# EAGLE design LedDriver (EAGLE 6.6.0)
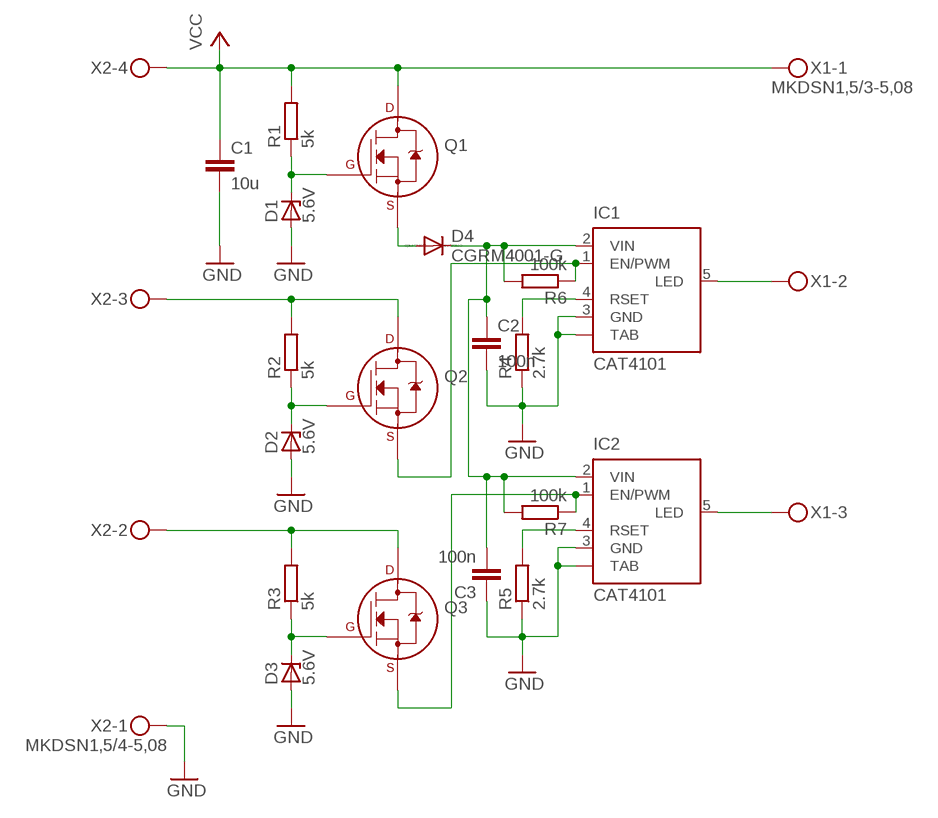
[diagram p0: schematic, sheet 1]

## Parts
C1  10u  C-EUC1210  [C1210]
C2  100n  C-EUC0402  [C0402]
C3  100n  C-EUC0402  [C0402]
D1  5.6V  ZENER-DIODESOD80C  [SOD80C]
D2  5.6V  ZENER-DIODESOD80C  [SOD80C]
D3  5.6V  ZENER-DIODESOD80C  [SOD80C]
D4  CGRM4001-G  [SOD-123_MINI-SMA]
IC1  CAT4101  [TO263_5]
IC2  CAT4101  [TO263_5]
Q1  2N7002_SOT23  [SOT-23]
Q2  2N7002_SOT23  [SOT-23]
Q3  2N7002_SOT23  [SOT-23]
R1  5k  R-EU_R0603  [R0603]
R2  5k  R-EU_R0603  [R0603]
R3  5k  R-EU_R0603  [R0603]
R4  2.7k  R-EU_R0603  [R0603]
R5  2.7k  R-EU_R0603  [R0603]
R6  100k  R-EU_R0603  [R0603]
R7  100k  R-EU_R0603  [R0603]
X1  MKDSN1,5/3-5,08  [MKDSN1,5/3-5,08]
X2  MKDSN1,5/4-5,08  [MKDSN1,5/4-5,08]

## Nets
GND [VCC]: C1.2 C2.2 C3.1 D1.A D2.A D3.A IC1.3(GND) IC1.TAB IC2.3(GND) IC2.TAB R4.1 R5.1 X2.1
N$1: D1.C Q1.1(G) R1.1
N$2: D4.A Q1.2(S)
N$3: Q2.3(D) R2.2 X2.3
N$4: D2.C Q2.1(G) R2.1
N$5: Q3.3(D) R3.2 X2.2
N$6: D3.C Q3.1(G) R3.1
N$7: IC1.1(EN/PWM) Q2.2(S) R6.1
N$8: IC2.1(EN/PWM) Q3.2(S) R7.1
N$9: C2.1 C3.2 D4.C IC1.2(VIN) IC2.2(VIN) R6.2 R7.2
N$10: IC2.4(RSET) R5.2
N$11: IC1.4(RSET) R4.2
N$14 [VCC]: IC1.5(LED) X1.2
N$15 [VCC]: IC2.5(LED) X1.3
VCC [VCC]: C1.1 Q1.3(D) R1.2 X1.1 X2.4

## Library data of the parts
C1-C3 = rcl:C-EU: CAPACITOR, European symbol
D1-D3 = diode:ZENER-DIODE: Z-Diode
D4 = diode:CGRM400*-G: Molded plasitc,JEDEC SOD-123/Mini SMA Source: Comchip CGRM4001-G.pdf
IC1 IC2 = on-semiconductor:CAT4101: 1A Constant-Current LED Driver with PWM Dimming Source: ON Semiconductor .. 4101.pdf; MPN: CAT4101TV-T75; OC_FARNELL: 1718452; OC_NEWARK: 08R5264
Q1-Q3 = transistors:2N700*: 2N7000, 2N7002, NDS7002A N-channel enhancement mode MOSFET
R1-R7 = rcl:R-EU_: RESISTOR, European symbol
X1 = con-phoenix-508:MKDSN1,5/3-5,08: MKDSN 1,5/ 3-5,08 Printklemme Nennstrom: 13,5 A Nennspannung: 250 V Rastermaß: 5,08 mm Polzahl: 3 Anschlussart: Schraubanschluss Montage: Löten Anschlussrichtung Leiter/Platine: 0 ° Artikelnummer: 1729131 Source: http://eshop.phoenixcontact.com .. 1729131.pdf; MPN: SMKDSN1,5/3-5,08; OC_FARNELL: 1792904; OC_NEWARK: 70R0299
X2 = con-phoenix-508:MKDSN1,5/4-5,08: MKDSN 1,5/ 4-5,08 Printklemme Nennstrom: 13,5 A Nennspannung: 250 V Rastermaß: 5,08 mm Polzahl: 4 Anschlussart: Schraubanschluss Montage: Löten Anschlussrichtung Leiter/Platine: 0 ° Artikelnummer: 1729144 Source: http://eshop.phoenixcontact.com .. 1729144.pdf; MPN: SMKDSN1,5/4-5,08; OC_FARNELL: 1792905; OC_NEWARK: 70R0300

## Net classes
0 default: width 0.406 mm
1 VCC: width 0.762 mm

## Board
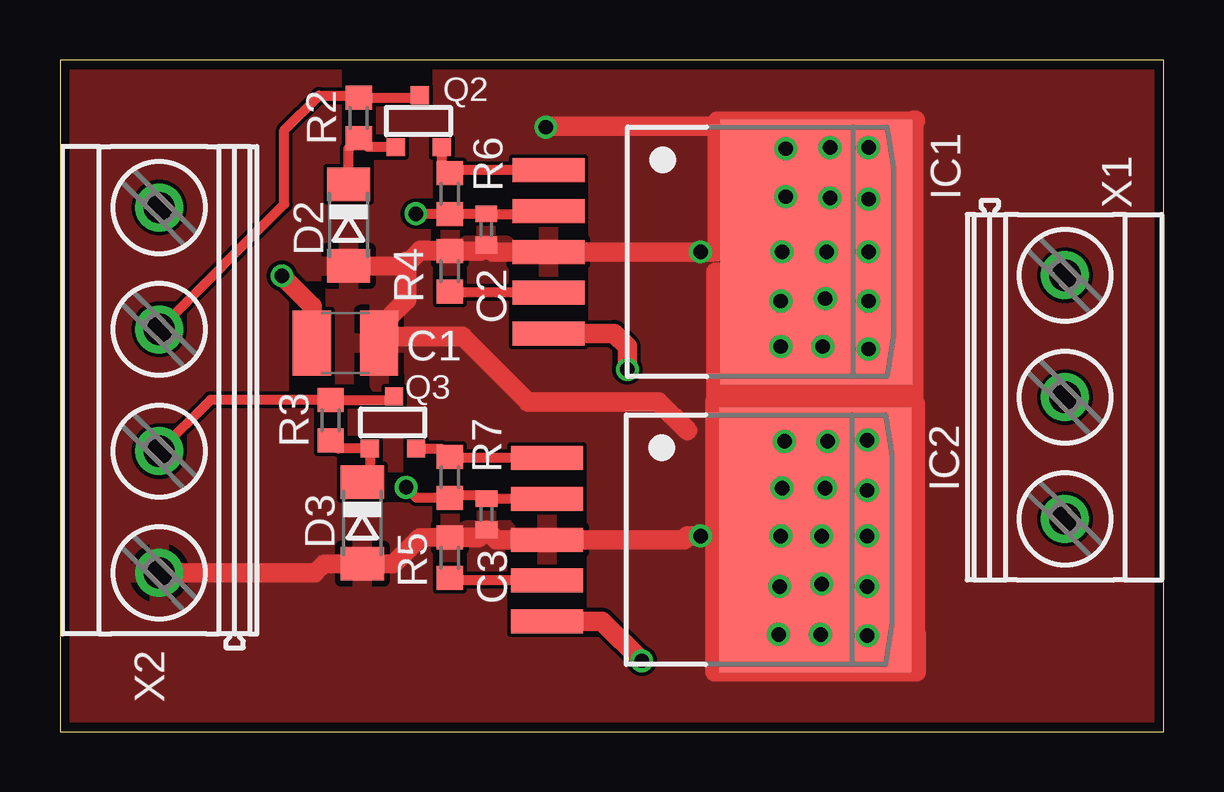
[diagram p1: board, top side]
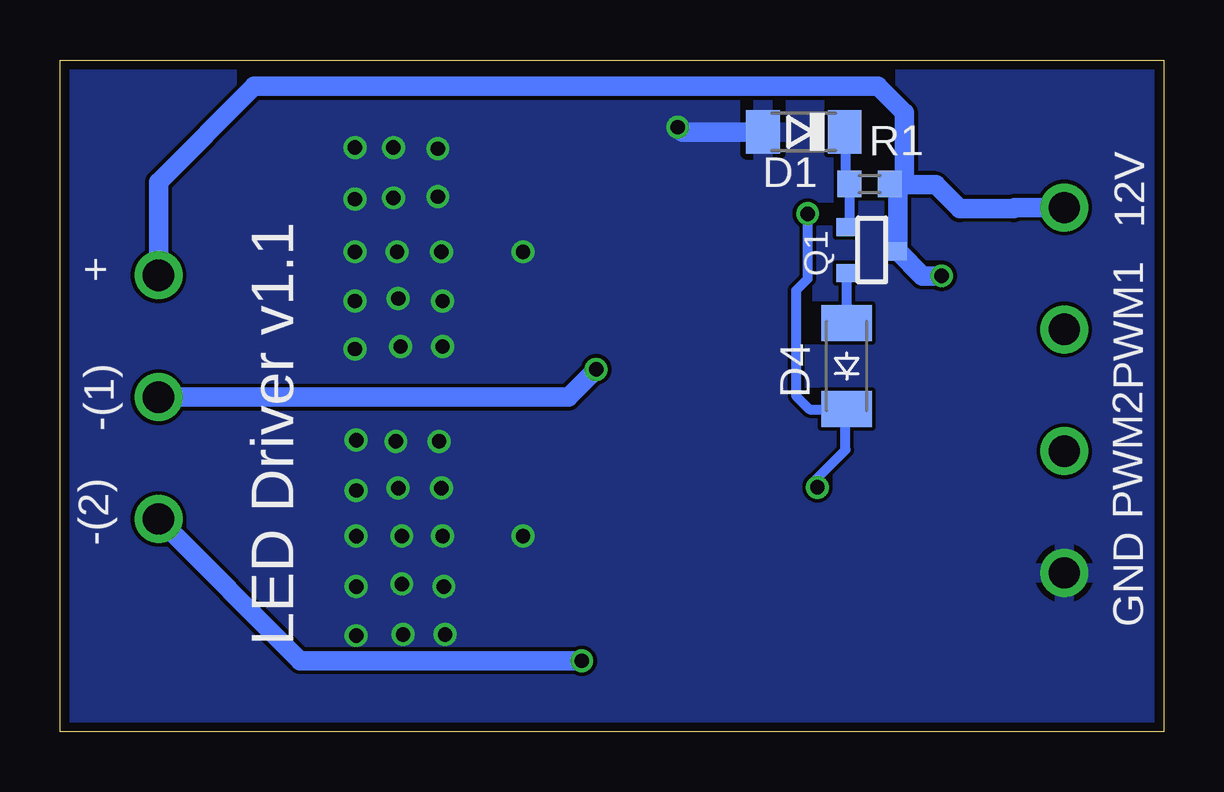
[diagram p2: board, bottom side, seen from below]

Size 46 x 28 mm. Coordinates in mm from the lower left corner, seen from the top.
Outline: 0,0 46,0 46,28 0,28 0,0
Copper layers (1*16): Top 0.0356mm / dielectric 1.5011mm / Bottom 0.0356mm
Design rules "PCBs_io": minimum track width 6mil, minimum drill 13mil, track to track 6mil, track to pad 6mil, pad to pad 6mil, via to via 6mil, smd to smd 6mil, copper to edge 15mil, drill to drill 6mil, minimum pad ring 7mil, minimum via ring 7mil, stop-mask expansion 3mil, vias tented up to drill 0mil, thermal gap 10mil

### Footprints (pad centres in the part's own frame; a part is rotated, then mirrored left to right if it is on the bottom)
C1210 = smd 1.6 x 2.7: 1 -1.4,0; 2 1.4,0
C0402 = smd 0.7 x 0.9: 1 -0.65,0; 2 0.65,0
SOD80C = smd 1.4 x 1.8: A 1.7,0; C -1.7,0
SOD-123_MINI-SMA = smd 1.5 x 2.1: A 1.8,0; C -1.8,0
TO263_5 = smd 1 x 3: 1 -3.4,-8; 2 -1.7,-8; 3 0,-8; 4 1.7,-8; 5 3.4,-8 | smd 11 x 8: TAB 0,3.175
SOT-23 = smd 0.762 x 0.762: 1 -0.979,-1.101; 2 0.94,-1.101; 3 0.025,1.067
R0603 = smd 1 x 1.1: 1 -0.85,0; 2 0.85,0
MKDSN1,5/3-5,08 = drill 1.3 pad 2: 1 -7.641,0.025; 2 -2.561,0.025; 3 2.519,0.025
MKDSN1,5/4-5,08 = drill 1.3 pad 2: 1 -7.641,0.025; 2 -2.561,0.025; 3 2.519,0.025; 4 7.599,0.025

### Placement (x,y rotation side)
C1  11.9,16.2 0 top
C2  17.77,20.93 270 top
C3  17.78,9.06 90 top
D1  15,25 180 bottom
D2  12.03,21.11 270 top
D3  12.6,8.7 270 top
D4  13.21,15.24 90 bottom
IC1  28.36,20 270 top
IC2  28.31,8 270 top
Q1  12.15,20.05 270 bottom
Q2  14.97,25.47 0 top
Q3  13.9,12.9 0 top
R1  12.25,22.83 0 bottom
R2  12.46,25.58 90 top
R3  11.28,12.98 90 top
R4  16.25,19.19 270 top
R5  16.25,7.25 270 top
R6  16.25,22.42 270 top
R7  16.25,10.6 270 top
X1  41.87,11.38 270 top
X2  4.16,14.25 90 top

### Tracks (layer width: path | path; a pad name or v marks a point on that pad's centre or on a via)
GND  (via drill 0.6)
  Top 0.762: 10.61,6.61 11,7 D3.A 13.91,7 15.01,8.1 R5.1 | D2.A 14.39,19.41 14.45,19.36
  Top 0.813: X2.1 10.61,6.61 | R5.1 17.47,8.1 C3.1 18.19,8 IC2.3 26,8 26.15,8.15 v26.7,8.15 31.34,8.15 IC2.TAB | 26.15,12.55 24.95,13.75 19.5,13.75 16.78,16.47 13.3,16.47 C1.2 13.5,16.4 13.5,17.05 14.45,18 14.45,19.36 14.45,19.62 14.57,19.62 15,20.05 R4.1 17.53,20.04 C2.2 18.05,20 IC1.3 v26.7,20 27.35,20 27.35,20.05 27.4,20.05 27.4,25.45 35.65,25.45 35.65,25.5 35.6,25.5 35.6,13.95 35.15,13.95 35.15,14.5 27.45,14.5 27.45,19.15 27.35,19.15 27.35,13.75 35.6,13.75 35.6,13.65 35.65,13.65 35.65,4.05 35.7,4.05 35.7,2.5 27.3,2.5 27.3,13.75 30.5,13.75 30.5,19.85 30.55,19.85 30.55,20 | IC1.TAB 30.55,20 | 30.55,20 30.2,20.35 30.2,23.75 28.7,25.25 20.45,25.25 20.4,25.2 v20.25,25.2 | 30.55,20 30.55,20.05
  Bottom 0.813: D1.A 20.05,25 v20.25,25.2
  other vias: 30.25,24.3 30.25,22.3 31.9,18.05 30.1,20 31.8,16.05 30.05,17.95 30.05,16.05 33.7,24.35 33.7,20 33.7,22.2 32.1,24.35 32.1,22.25 33.7,15.95 33.7,17.95 31.95,20 31.9,10.15 31.75,6.15 31.75,8.15 30.2,12.1 31.7,4.05 30.1,10.15 30.05,8.15 29.95,4.05 30,6.05 33.65,12.15 32,12.1 33.65,4 33.65,8.15 33.65,10.05 33.65,6.05
  pour Bottom: 0,28 46,28 46,0 0,0
  pour Top: 0,0 46,0 46,28 0,28
N$1
  Bottom 0.406: Q1.1 13.1,21.18 R1.1 13.25,22.98 13.25,24.95 D1.C
N$2
  Bottom 0.406: D4.A 13.21,19.07 Q1.2
N$3
  Top 0.406: X2.3 9.35,21.98 9.35,25.07 10.79,26.52 12.37,26.52 R2.2 14.9,26.43 Q2.3
N$4
  Top 0.406: Q2.1 12.83,24.36 R2.1 12.03,24.31 D2.C
N$5
  Top 0.406: X2.2 6.28,13.83 R3.2 13.79,13.83 Q3.3
N$6
  Top 0.406: D3.C 12.92,10.72 Q3.1 11.61,11.8 R3.1
N$7
  Top 0.406: IC1.1 16.38,23.4 R6.1 15.91,23.61 Q2.2
N$8
  Top 0.406: IC2.1 16.3,11.4 R7.1 15.9,11.8 Q3.2
N$9  (via drill 0.6)
  Top 0.406: IC1.2 20.24,21.58 C2.1 17.75,21.6 16.56,21.6 | IC2.2 C3.2 17.64,9.85 16.35,9.85 R7.2 14.86,9.75 v14.43,10.19 | 16.56,21.6 14.84,21.6 v14.83,21.59 | R6.2 16.53,21.57 16.56,21.6
  Bottom 0.406: v14.43,10.19 14.43,10.57 13.25,11.75 13.25,13.4 D4.C 14.76,13.44 15.32,13.99 15.32,18.39 14.83,18.87 v14.83,21.59
N$10
  Top 0.406: IC2.4 16.35,6.3 R5.2
N$11
  Top 0.406: IC1.4 16.29,18.3 R4.2
N$14  (via drill 0.6)
  Top 0.813: v23.65,15.1 23.65,16.05 23.1,16.6 IC1.5
  Bottom 0.813: X1.2 24.81,13.94 v23.65,15.1
N$15  (via drill 0.6)
  Top 0.813: IC2.5 22.6,4.6 v24.25,2.95
  Bottom 0.813: v24.25,2.95 35.98,2.95 X1.3
VCC  (via drill 0.6)
  Top 0.813: C1.1 10.5,17.75 v9.25,19
  Bottom 0.813: X2.4 6.2,21.85 6.25,21.8 8.5,21.8 9.5,22.8 10.65,22.8 | 10.65,22.8 11.37,22.8 R1.2 11.08,22.51 Q1.3 | 11.01,19.95 Q1.3 | X1.1 41.9,22.91 37.9,26.9 11.9,26.9 10.8,25.8 10.8,22.95 10.65,22.8 | v9.25,19 10.06,19 Q1.3

### Text on the board
bNames: 12V | PWM1 | + | -(1) | PWM2 | -(2) | GND | LED Driver v1.1